# EAGLE schematic Esquematicos (EAGLE 9.5.2)

## Sheet 1 of 3: Fuente de corriente constante de 80mA La fuente de corriente mantendra el sensor de flujo de hilo caliente en 80mA.
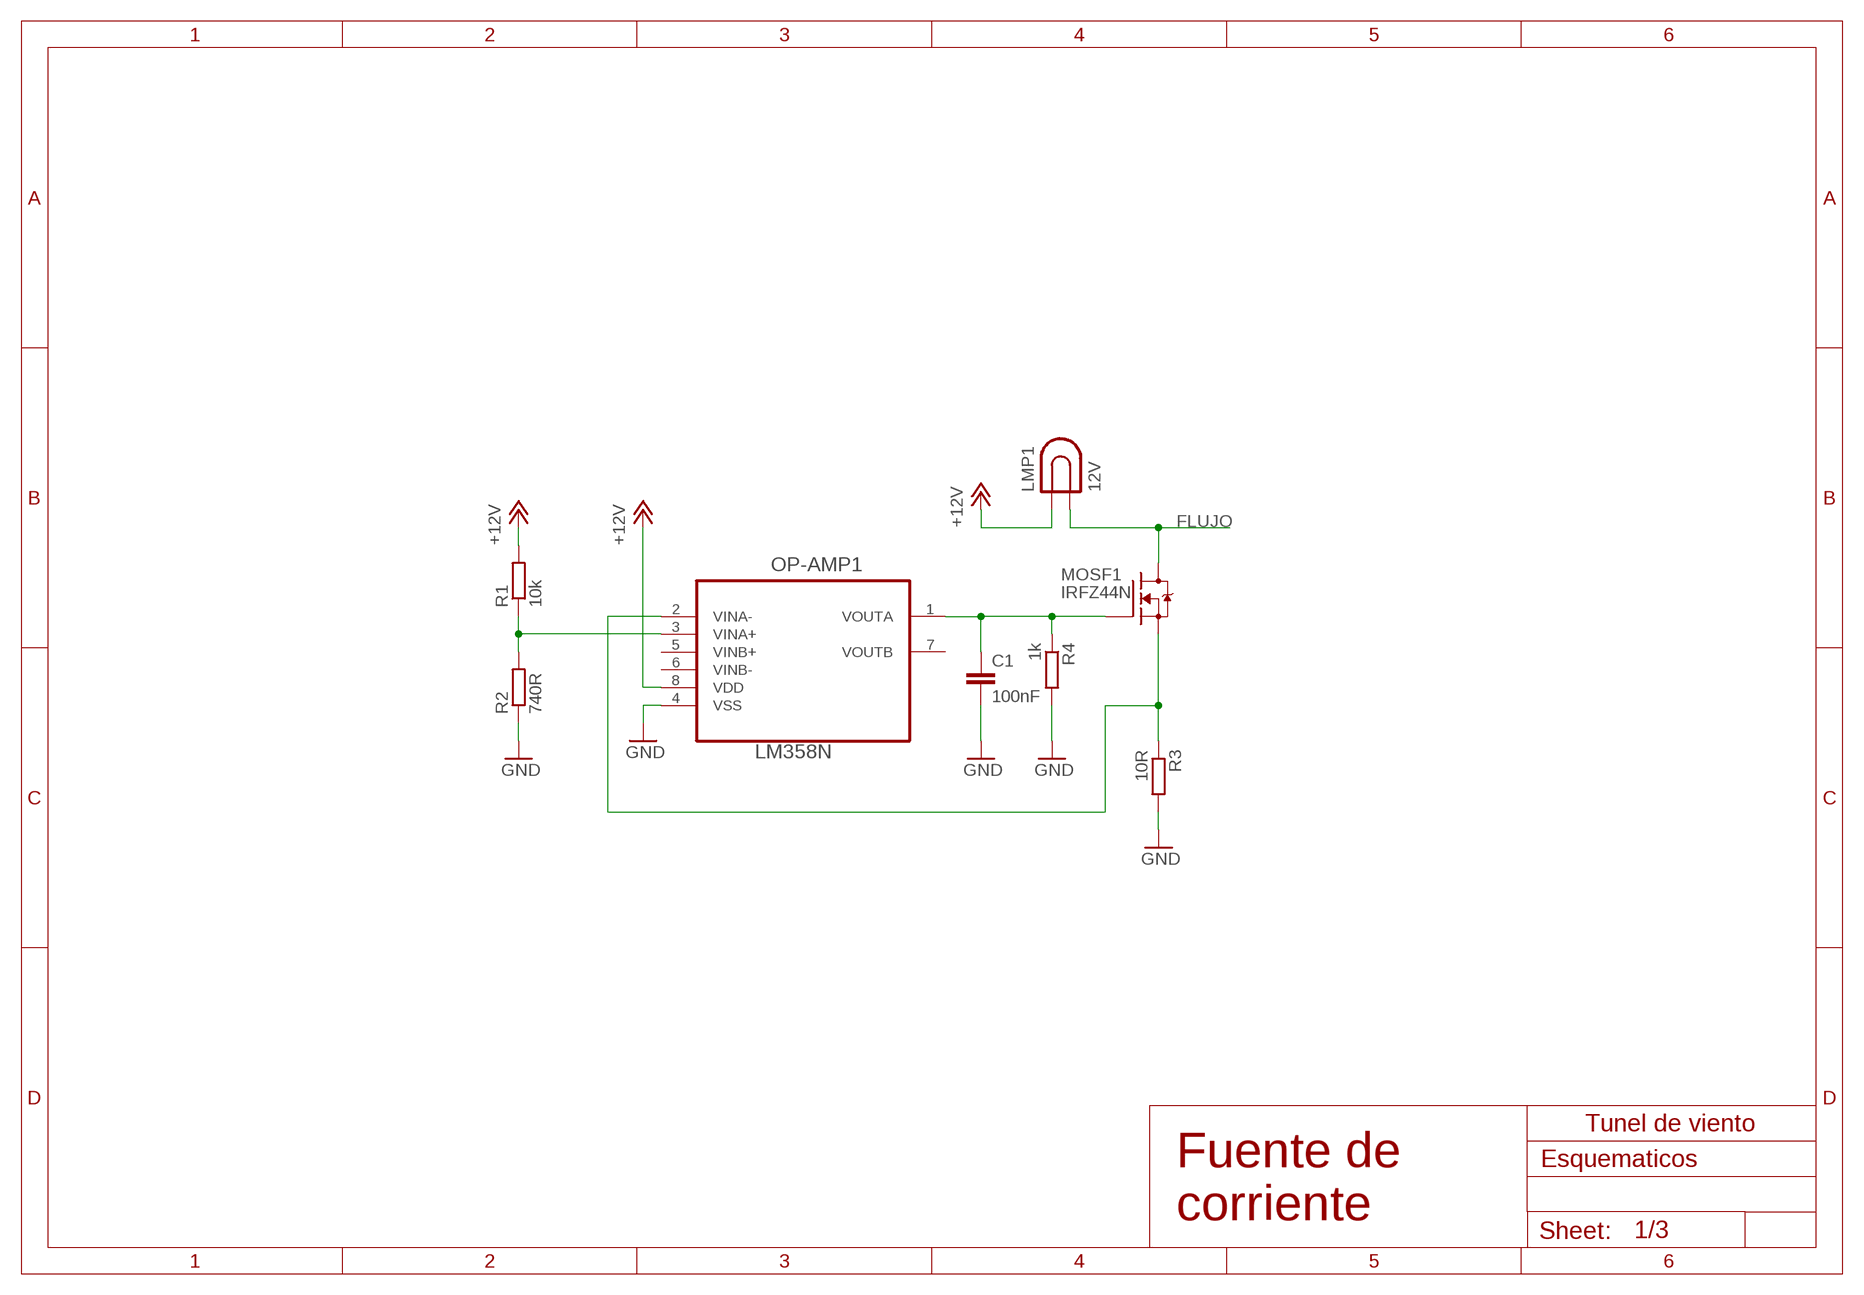
[diagram p0: schematic, sheet 1]

### Parts
C1  100nF  C-EU050-024X044  [C050-024X044]
LMP1  12V  LAMP  [LDH-5R]
MOSF1  IRFZ44N  [TO220V]
OP-AMP1  LM358N  [DIL8]
R1  10k  R-EU_0207/10  [0207/10]
R2  740R  R-EU_0207/10  [0207/10]
R3  10R  R-EU_0207/10  [0207/10]
R4  1k  R-EU_0207/10  [0207/10]

### Nets
+12V: LMP1.1 OP-AMP1.8(VDD) R1.2 ; also sheet 2,3
FLUJO: LMP1.2 MOSF1.1(D) ; also sheet 3
GND: C1.2 OP-AMP1.4(VSS) R2.1 R3.2 R4.2 ; also sheet 2,3
N$1: OP-AMP1.3(VINA+) R1.1 R2.2
N$2: C1.1 MOSF1.2(G) OP-AMP1.1(VOUTA) R4.1
N$3: MOSF1.3(S) OP-AMP1.2(VINA-) R3.1
Unconnected: OP-AMP1.5(VINB+) OP-AMP1.6(VINB-) OP-AMP1.7(VOUTB)

### Notes on the sheet
- Tunel de viento
- Fuente de
  corriente

## Sheet 2 of 3: Linealización de la curva de voltaje de un NTC Para poder linealizar un ntc se conecta una resistencia en serie.
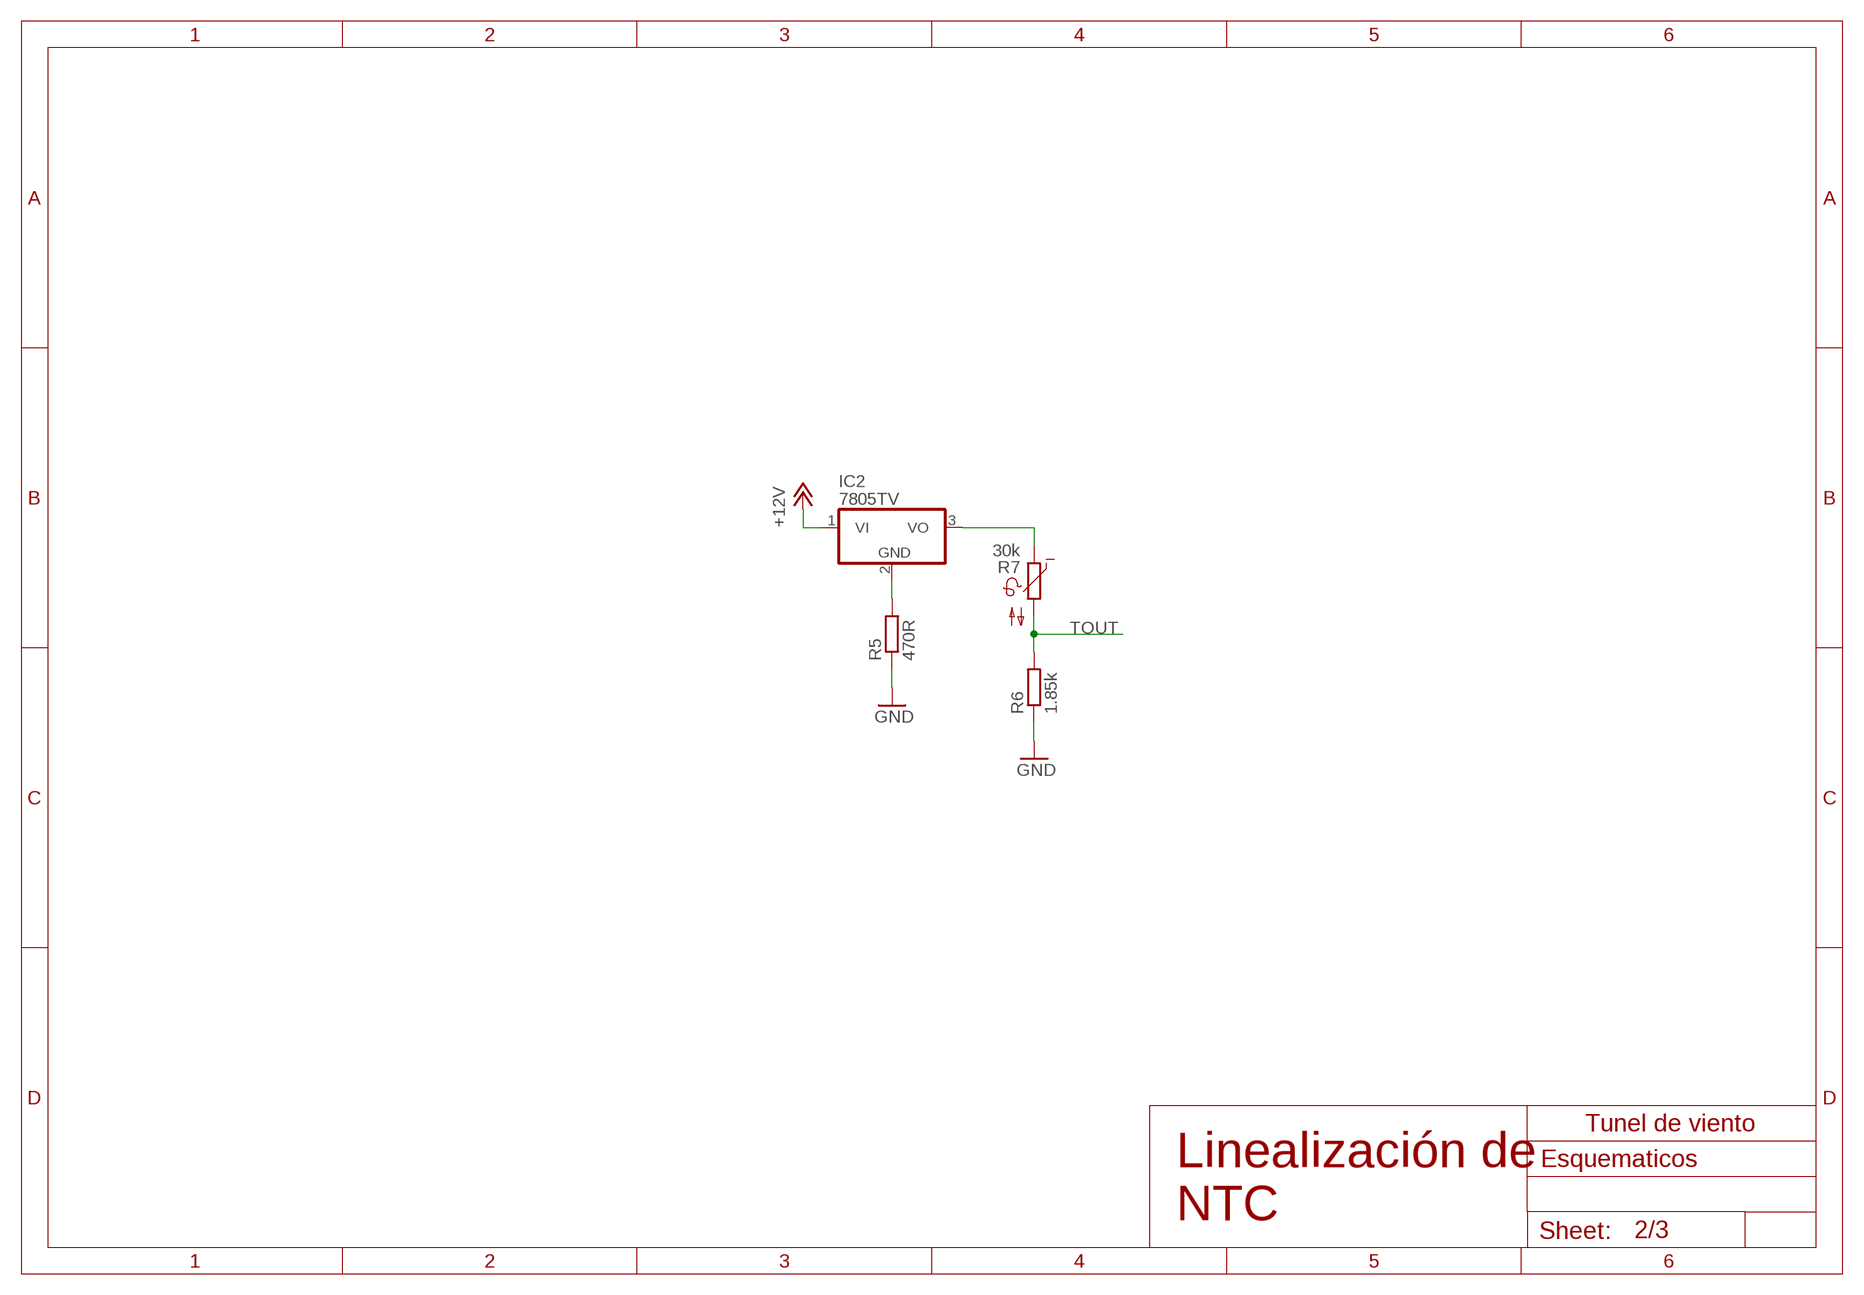
[diagram p1: schematic, sheet 2]

### Parts
IC2  7805TV  [TO220V]
R5  470R  R-EU_0207/10  [0207/10]
R6  1.85k  R-EU_0207/10  [0207/10]
R7  30k  NTC640  [P640]

### Nets
+12V: IC2.1(VI) ; also sheet 1,3
GND: R5.1 R6.1 ; also sheet 1,3
N$4: IC2.2(GND) R5.2
N$5: IC2.3(VO) R7.1
TOUT: R6.2 R7.2 ; also sheet 3

### Notes on the sheet
- Tunel de viento
- Linealización de
  NTC

## Sheet 3 of 3: Centro de control El controlador del tunel será un Arduino que se encargara de las funciones principales. Se podrá conectar mediante un cable USB a un ordenador con Windows.
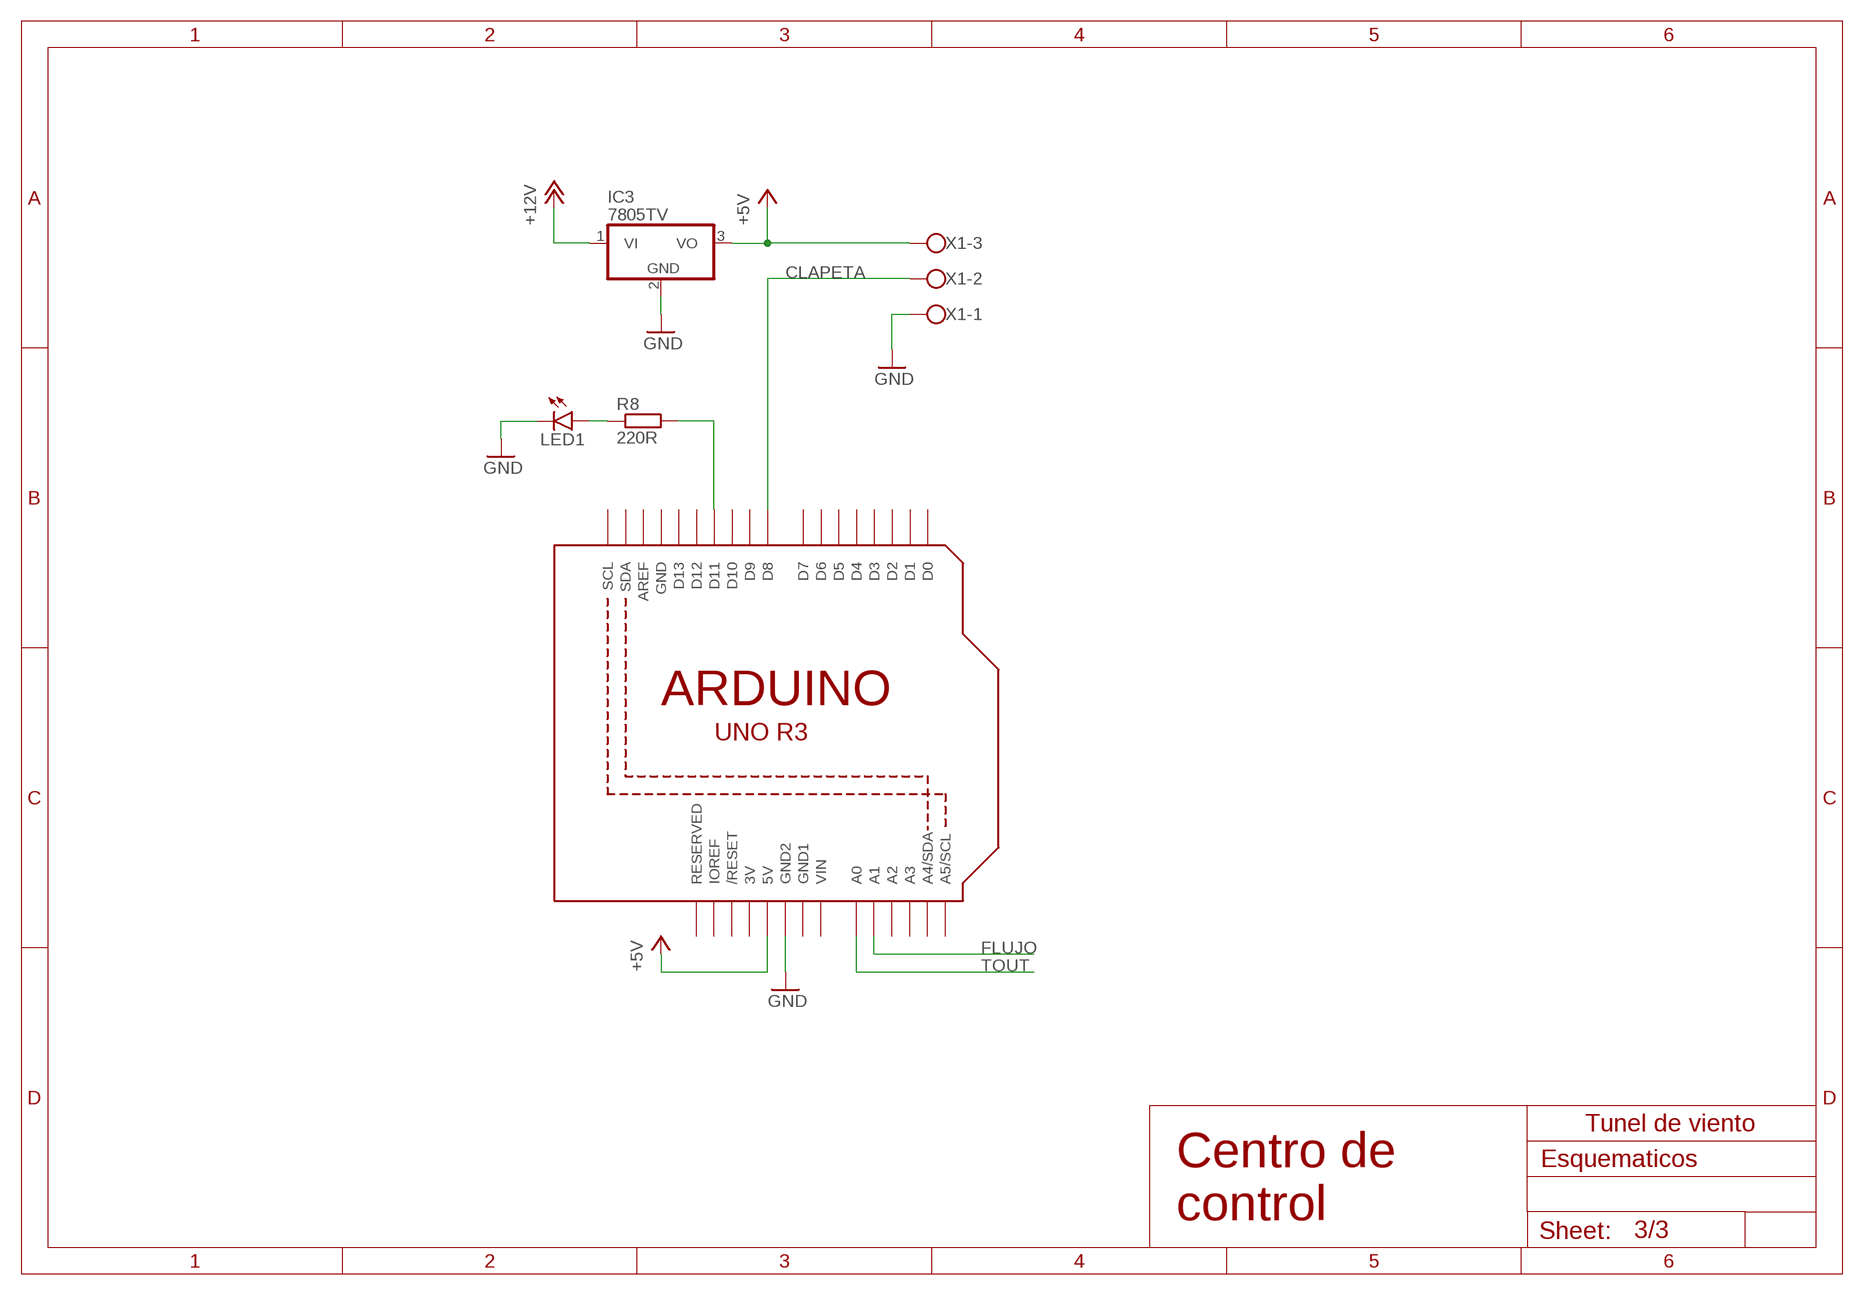
[diagram p2: schematic, sheet 3]

### Parts
IC3  7805TV  [TO220V]
LED1  LED5MM  [LED5MM]
R8  220R  R-EU_0204/7  [0204/7]
U1  ARDUINOR3-BPLACE  [ARDUINOR3-BPLACE]
X1  W237-103  [W237-103]

### Nets
+5V: IC3.3(VO) U1.5V X1.3
+12V: IC3.1(VI) ; also sheet 1,2
CLAPETA: U1.D8 X1.2
FLUJO: U1.A1 ; also sheet 1
GND: IC3.2(GND) LED1.K(C) U1.GND2 X1.1 ; also sheet 1,2
N$6: LED1.A R8.1
N$7: R8.2 U1.D11
TOUT: U1.A0 ; also sheet 2
Unconnected: U1.A2 U1.A3 U1.A4(A4/SDA) U1.A5(A5/SCL) U1.AREF U1.D0 U1.D1 U1.D2 U1.D3 U1.D4 U1.D5 U1.D6 U1.D7 U1.D9 U1.D10 U1.D12 U1.D13 U1.IOREF U1.RESERVED U1.RESET(/RESET) U1.SCL U1.SDA

### Notes on the sheet
- Tunel de viento
- Centro de
  control

## Power pins joined to a net without a drawn wire
3V: U1.3V
GND: U1.GND
GND1: U1.GND1
VIN: U1.VIN

## Library data of the parts
C1 = rcl:C-EU: CAPACITOR, European symbol; SPICEPREFIX: C
IC2 IC3 = linear:78*: Positive VOLTAGE REGULATOR Source: http://cache.national.com/ds/LM/LM78L05.pdf http://www.fairchildsemi.com/ds/LM/LM7805.pdf
LED1 = led:LED: LED OSRAM: - CHIPLED LG R971, LG N971, LY N971, LG Q971, LY Q971, LO R971, LY R971 LH N974, LH R974 LS Q976, LO Q976, LY Q976 LO Q996 - Hyper CHIPLED LW Q18S LB Q993, LB Q99A, LB R99A - SideLED LS A670, LO A670, LY A670, LG A670, LP A670 LB A673, LV A673, LT A673, LW A673 LH A674 LY A675 LS A676, LA A676, LO A676, LY A676, LW A676 LS A679, LY A679, LG A679 - Hyper Micro SIDELED® LS Y876, LA Y876, LO Y876, LY Y876 LT Y87S - SmartLED LW L88C, LW L88S LB L89C, LB L89S, LG L890 LS L89K, LO L89K, LY L89K LS L896, LA L896, LO L896, LY L896 - TOPLED LS T670, LO T670, LY T670, LG T670, LP T670 LSG T670, LSP T670, LSY T670, LOP T670, LYG T670 LG T671, LOG T671, LSG T671 LB T673, LV T673, LT T673, LW T673 LH T674 LS T676, LA T676, LO T676, LY T676, LB T676, LH T676, LSB T676, LW T676 LB T67C, LV T67C, LT T67C, LS T67K, LO T67K, LY T67K, LW E67C LS E67B, LA E67B, LO E67B, LY E67B, LB E67C, LV E67C, LT E67C LW T67C LS T679, LY T679, LG T679 LS T770, LO T770, LY T770, LG T770, LP T770 LB T773, LV T773, LT T773, LW T773 LH T774 LS E675, LA E675, LY E675, LS T675 LS T776, LA T776, LO T776, LY T776, LB T776 LHGB T686 LT T68C, LB T68C - Hyper Mini TOPLED® LB M676 - Mini TOPLED Santana® LG M470 LS M47K, LO M47K, LY M47K Source: http://www.osram.convergy.de LUXEON: - LUMILED® LXK2-PW12-R00, LXK2-PW12-S00, LXK2-PW14-U00, LXK2-PW14-V00 LXK2-PM12-R00, LXK2-PM12-S00, LXK2-PM14-U00 LXK2-PE12-Q00, LXK2-PE12-R00, LXK2-PE12-S00, LXK2-PE14-T00, LXK2-PE14-U00 LXK2-PB12-K00, LXK2-PB12-L00, LXK2-PB12-M00, LXK2-PB14-N00, LXK2-PB14-P00, LXK2-PB14-Q00 LXK2-PR12-L00, LXK2-PR12-M00, LXK2-PR14-Q00, LXK2-PR14-R00 LXK2-PD12-Q00, LXK2-PD12-R00, LXK2-PD12-S00 LXK2-PH12-R00, LXK2-PH12-S00 LXK2-PL12-P00, LXK2-PL12-Q00, LXK2-PL12-R00 Source: www.luxeon.com KINGBRIGHT: KA-3528ASYC Source: www.kingbright.com
LMP1 = special:LAMP: LED HOLDER
MOSF1 = mosfets:IRFZ44N: IRFZ44N Mosfet chanel N
OP-AMP1 = op-amp:LM358N: LM358N Amplificador operacional dual
R1-R6 R8 = rcl:R-EU_: RESISTOR, European symbol; SPICEPREFIX: R
R7 = ptc-ntc:NTC640: PHILIPS NTC; OC_FARNELL: unknown; OC_NEWARK: unknown
U1 = adafruit:ARDUINOR3: This is a new object for the new Arduino R3 - with extra pins that you may want to use (such as IOref, and duplicated A4/A5
X1 = con-wago-500:W237-103: WAGO SCREW CLAMP; MPN: 237-103; OC_FARNELL: unknown; OC_NEWARK: 18M7116